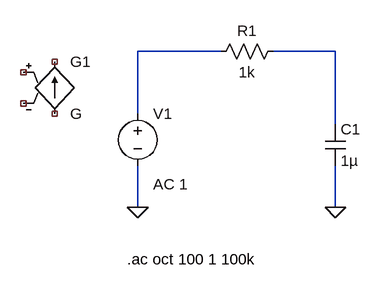
[diagram p0: schematic Draft4.asc]
Draft4.asc, the LTspice schematic file:
Version 4
SHEET 1 880 680
WIRE 208 48 80 48
WIRE 384 48 288 48
WIRE 80 144 80 48
WIRE 384 160 384 48
WIRE 80 288 80 224
WIRE 384 288 384 224
FLAG 80 288 0
FLAG 384 288 0
SYMBOL voltage 80 128 R0
WINDOW 123 24 124 Left 2
WINDOW 39 0 0 Left 0
SYMATTR Value2 AC 1
SYMATTR InstName V1
SYMATTR Value ""
SYMBOL res 304 32 R90
WINDOW 0 0 56 VBottom 2
WINDOW 3 32 56 VTop 2
SYMATTR InstName R1
SYMATTR Value 1k
SYMBOL cap 368 160 R0
SYMATTR InstName C1
SYMATTR Value 1µ
SYMBOL g -48 48 R0
SYMATTR InstName G1
TEXT 64 368 Left 2 !.ac oct 100 1 100k

The netlist it stands for:
* Draft4.asc
V1 N001 0 AC 1
R1 N002 N001 1k
C1 N002 0 1µ
G1 NC_01 NC_02 NC_03 NC_04 G
.ac oct 100 1 100k
.backanno
.end